# EAGLE schematic can-ft_M2eeL9CoAo (EAGLE 9.6.2)
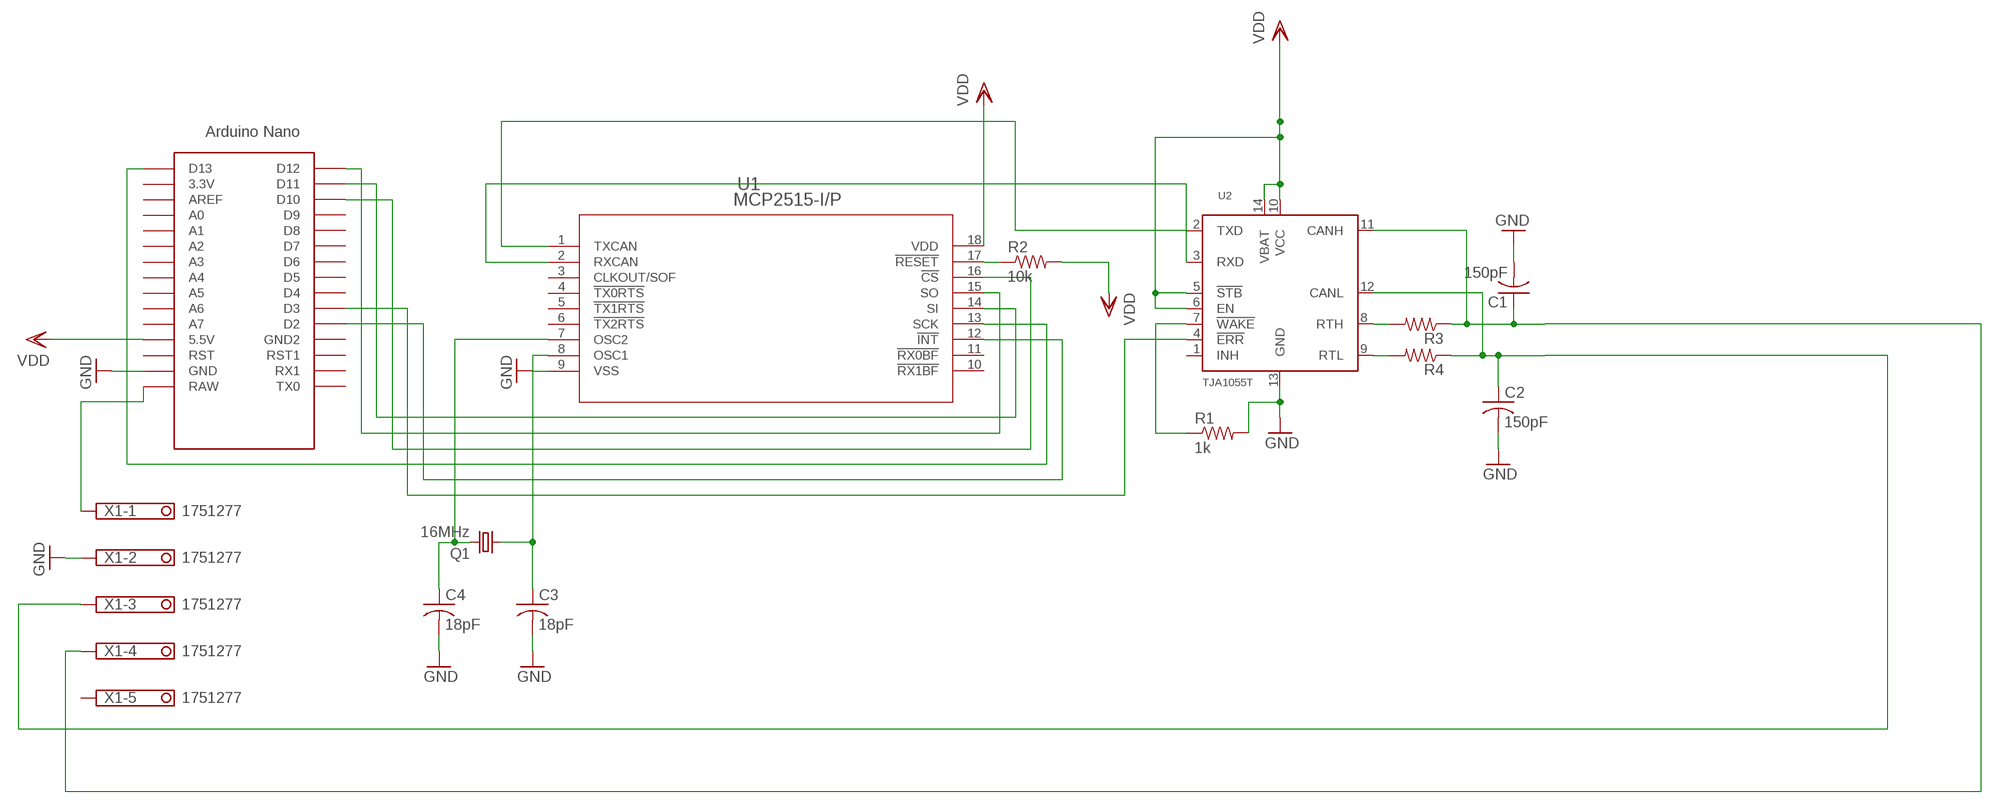
[diagram p0: schematic, sheet 1]

## Parts
C1  150pF  C-US050-025X075  [C050-025X075]
C2  150pF  C-US050-025X075  [C050-025X075]
C3  18pF  C-US050-025X075  [C050-025X075]
C4  18pF  C-US050-025X075  [C050-025X075]
Q1  16MHz  CRYSTALHC49S  [HC49/S]
R1  1k  R-US_0207/7  [0207/7]
R2  10k  R-US_0207/7  [0207/7]
R3  R-US_0207/7  [0207/7]
R4  R-US_0207/7  [0207/7]
U1  MCP2515-I/P  [PDIP18_300MC_MCH]
U2  TJA1055T  [SOT108-1]
U$1  NANO  [NANO]
X1  1751277  [1751277]

## Nets
GND: C1.2 C2.2 C3.2 C4.2 R1.2 U1.9(VSS) U2.13(GND) U$1.GND X1.2
N$1: U1.1(TXCAN) U2.2(TXD)
N$2: U1.2(RXCAN) U2.3(RXD)
N$3: R3.2 U2.8(RTH)
N$4: R4.2 U2.9(RTL)
N$5: C1.1 R3.1 U2.11(CANH) X1.4
N$6: C2.1 R4.1 U2.12(CANL) X1.3
N$7: U1.15(SO) U$1.D12
N$8: R1.1 U2.7(!WAKE)
N$9: U1.14(SI) U$1.D11
N$10: U1.16(!CS) U$1.D10
N$11: U1.13(SCK) U$1.D13
N$12: U1.12(!INT) U$1.D2
N$13: U2.4(!ERR) U$1.D3
N$14: R2.1 U1.17(!RESET)
N$15: C4.1 Q1.2 U1.7(OSC2)
N$16: C3.1 Q1.1 U1.8(OSC1)
N$17: U$1.RAW X1.1
VDD: R2.2 U1.18(VDD) U2.5(!STB) U2.6(EN) U2.10(VCC) U2.14(VBAT) U$1.5V(5.5V)
Unconnected: U1.3(CLKOUT/SOF) U1.4(!TX0RTS) U1.5(!TX1RTS) U1.6(!TX2RTS) U1.10(!RX1BF) U1.11(!RX0BF) U2.1(INH) U$1.3.3V U$1.A0 U$1.A1 U$1.A2 U$1.A3 U$1.A4 U$1.A5 U$1.A6 U$1.A7 U$1.AREF U$1.D4 U$1.D5 U$1.D6 U$1.D7 U$1.D8 U$1.D9 U$1.GND1(GND2) U$1.ICSP1 U$1.ICSP2 U$1.ICSP3 U$1.ICSP4 U$1.ICSP5 U$1.ICSP6 U$1.RST U$1.RST1 U$1.RX1 U$1.TX0 X1.5

## Library data of the parts
C1-C4 = adafruit:C-US: CAPACITOR, American symbol
Q1 = crystal:CRYSTAL: CRYSTAL; OC_FARNELL: 1667008; OC_NEWARK: unknown
R1-R4 = rcl:R-US_: RESISTOR, American symbol; SPICEPREFIX: R
U1 = MCP2515:MCP2515-I/P; BUILT_BY: EMA_UL_Team; MANUFACTURER_PART_NUMBER: MCP2515-I/P; SOURCELIBRARY: Microchip_2011-04-01; VENDOR: Microchip
U2 = NXP_60_26022015:TJA1055T: Enhanced fault-tolerant CAN transceiver The TJA1055 is the interface between the protocol controller and the physical bus wires in a Controller Area Network (CAN). It is primarily intended for low-speed applications up to 125 kBd in passenger cars. The device provides differential receive and transmit capability but will switch to single-wire transmitter and/or receiver in error conditions. The TJA1055 is the enhanced version of the TJA1054 and TJA1054A. TJA1055 has the same functionality but in addition offering a number of improvements. The most important improvements of the TJA1055 with respect to the TJA1054 and TJA1054A are: Improved ElectroStatic Discharge (ESD) performance Lower current consumption in sleep mode Wake-up signalling on RXD and ERR without VCC active 3 V interfacing with microcontroller possible with TJA1055T/3 AAL Eindhoven MK
U$1 = Arduino-clone:NANO: Arduino Nano
X1 = con-phoenix-350:1751277: MKDS 1/ 5-3,5 Printklemme Nennstrom: 10 A Bemessungsspannung: 160 V Raster: 3,5 mm Polzahl: 5 Montageart: Löten Anschlussart: Schraubanschluss Anschlussrichtung vom Leiter zur Platine: 0° Source: http://eshop.phoenixcontact.com .. 1751277.pdf; OC_FARNELL: unknown; OC_NEWARK: unknown

## Net classes
0 default: width 0.305 mm, drill 0.508 mm, clearance 0.254 mm